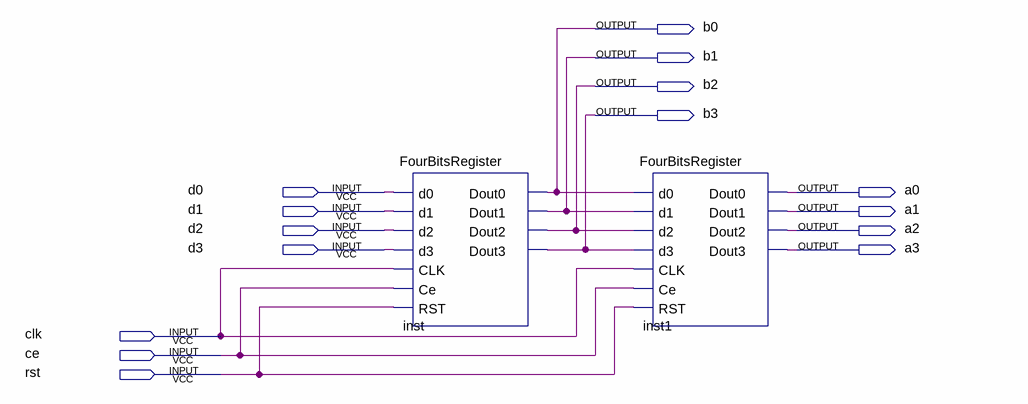
[diagram p0: schematic sheet]
// Quartus schematic Block3.bdf as structural Verilog: 2 symbols, 15 pins
module Block3 (
  input  d0,
  input  d1,
  input  d2,
  input  d3,
  input  clk,
  input  ce,
  input  rst,
  output b0,
  output b1,
  output b2,
  output b3,
  output a0,
  output a1,
  output a2,
  output a3
);

  FourBitsRegister inst (
    .d0(d0), .d1(d1), .d2(d2), .d3(d3), .CLK(clk), .Ce(ce), .RST(rst), .Dout0(b0), .Dout1(b1), .Dout2(b2),
    .Dout3(b3));
  FourBitsRegister inst1 (
    .d0(b0), .d1(b1), .d2(b2), .d3(b3), .CLK(clk), .Ce(ce), .RST(rst), .Dout0(a0), .Dout1(a1), .Dout2(a2),
    .Dout3(a3));
endmodule
